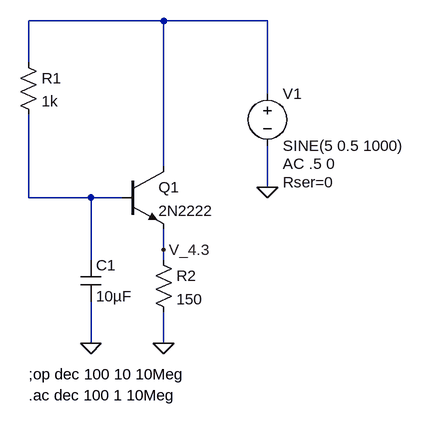
[diagram p0: schematic Smoother_Design_3.asc]
Smoother_Design_3.asc, the LTspice schematic file:
Version 4
SHEET 1 880 680
WIRE 320 16 112 16
WIRE 480 16 320 16
WIRE 112 80 112 16
WIRE 480 128 480 16
WIRE 320 240 320 16
WIRE 480 272 480 208
WIRE 112 288 112 160
WIRE 208 288 112 288
WIRE 256 288 208 288
WIRE 320 368 320 336
WIRE 208 384 208 288
WIRE 320 384 320 368
WIRE 208 512 208 448
WIRE 320 512 320 464
FLAG 480 272 0
FLAG 320 512 0
FLAG 208 512 0
FLAG 320 368 V_4.3
SYMBOL res 96 64 R0
SYMATTR InstName R1
SYMATTR Value 1k
SYMBOL npn 256 240 R0
SYMATTR InstName Q1
SYMATTR Value 2N2222
SYMBOL voltage 480 112 R0
WINDOW 123 24 124 Left 2
WINDOW 39 24 152 Left 2
SYMATTR Value2 AC .5 0
SYMATTR SpiceLine Rser=0
SYMATTR InstName V1
SYMATTR Value SINE(5 0.5 1000)
SYMBOL res 304 368 R0
SYMATTR InstName R2
SYMATTR Value 150
SYMBOL cap 192 384 R0
SYMATTR InstName C1
SYMATTR Value 10µF
TEXT 112 592 Left 2 !.ac dec 100 1 10Meg
TEXT 112 560 Left 2 !;op dec 100 10 10Meg

The netlist it stands for:
* Smoother_Design_3.asc
R1 N001 N002 1k
Q1 N001 N002 V_4.3 0 2N2222
V1 N001 0 SINE(5 0.5 1000) AC .5 0 Rser=0
R2 V_4.3 0 150
C1 N002 0 10µF
.model NPN NPN
.model PNP PNP
.lib standard.bjt
.ac dec 100 1 10Meg
;op dec 100 10 10Meg
.backanno
.end